# Altium schematic sheet BQ76940 20210906.SchDoc
size 419 x 297 mm
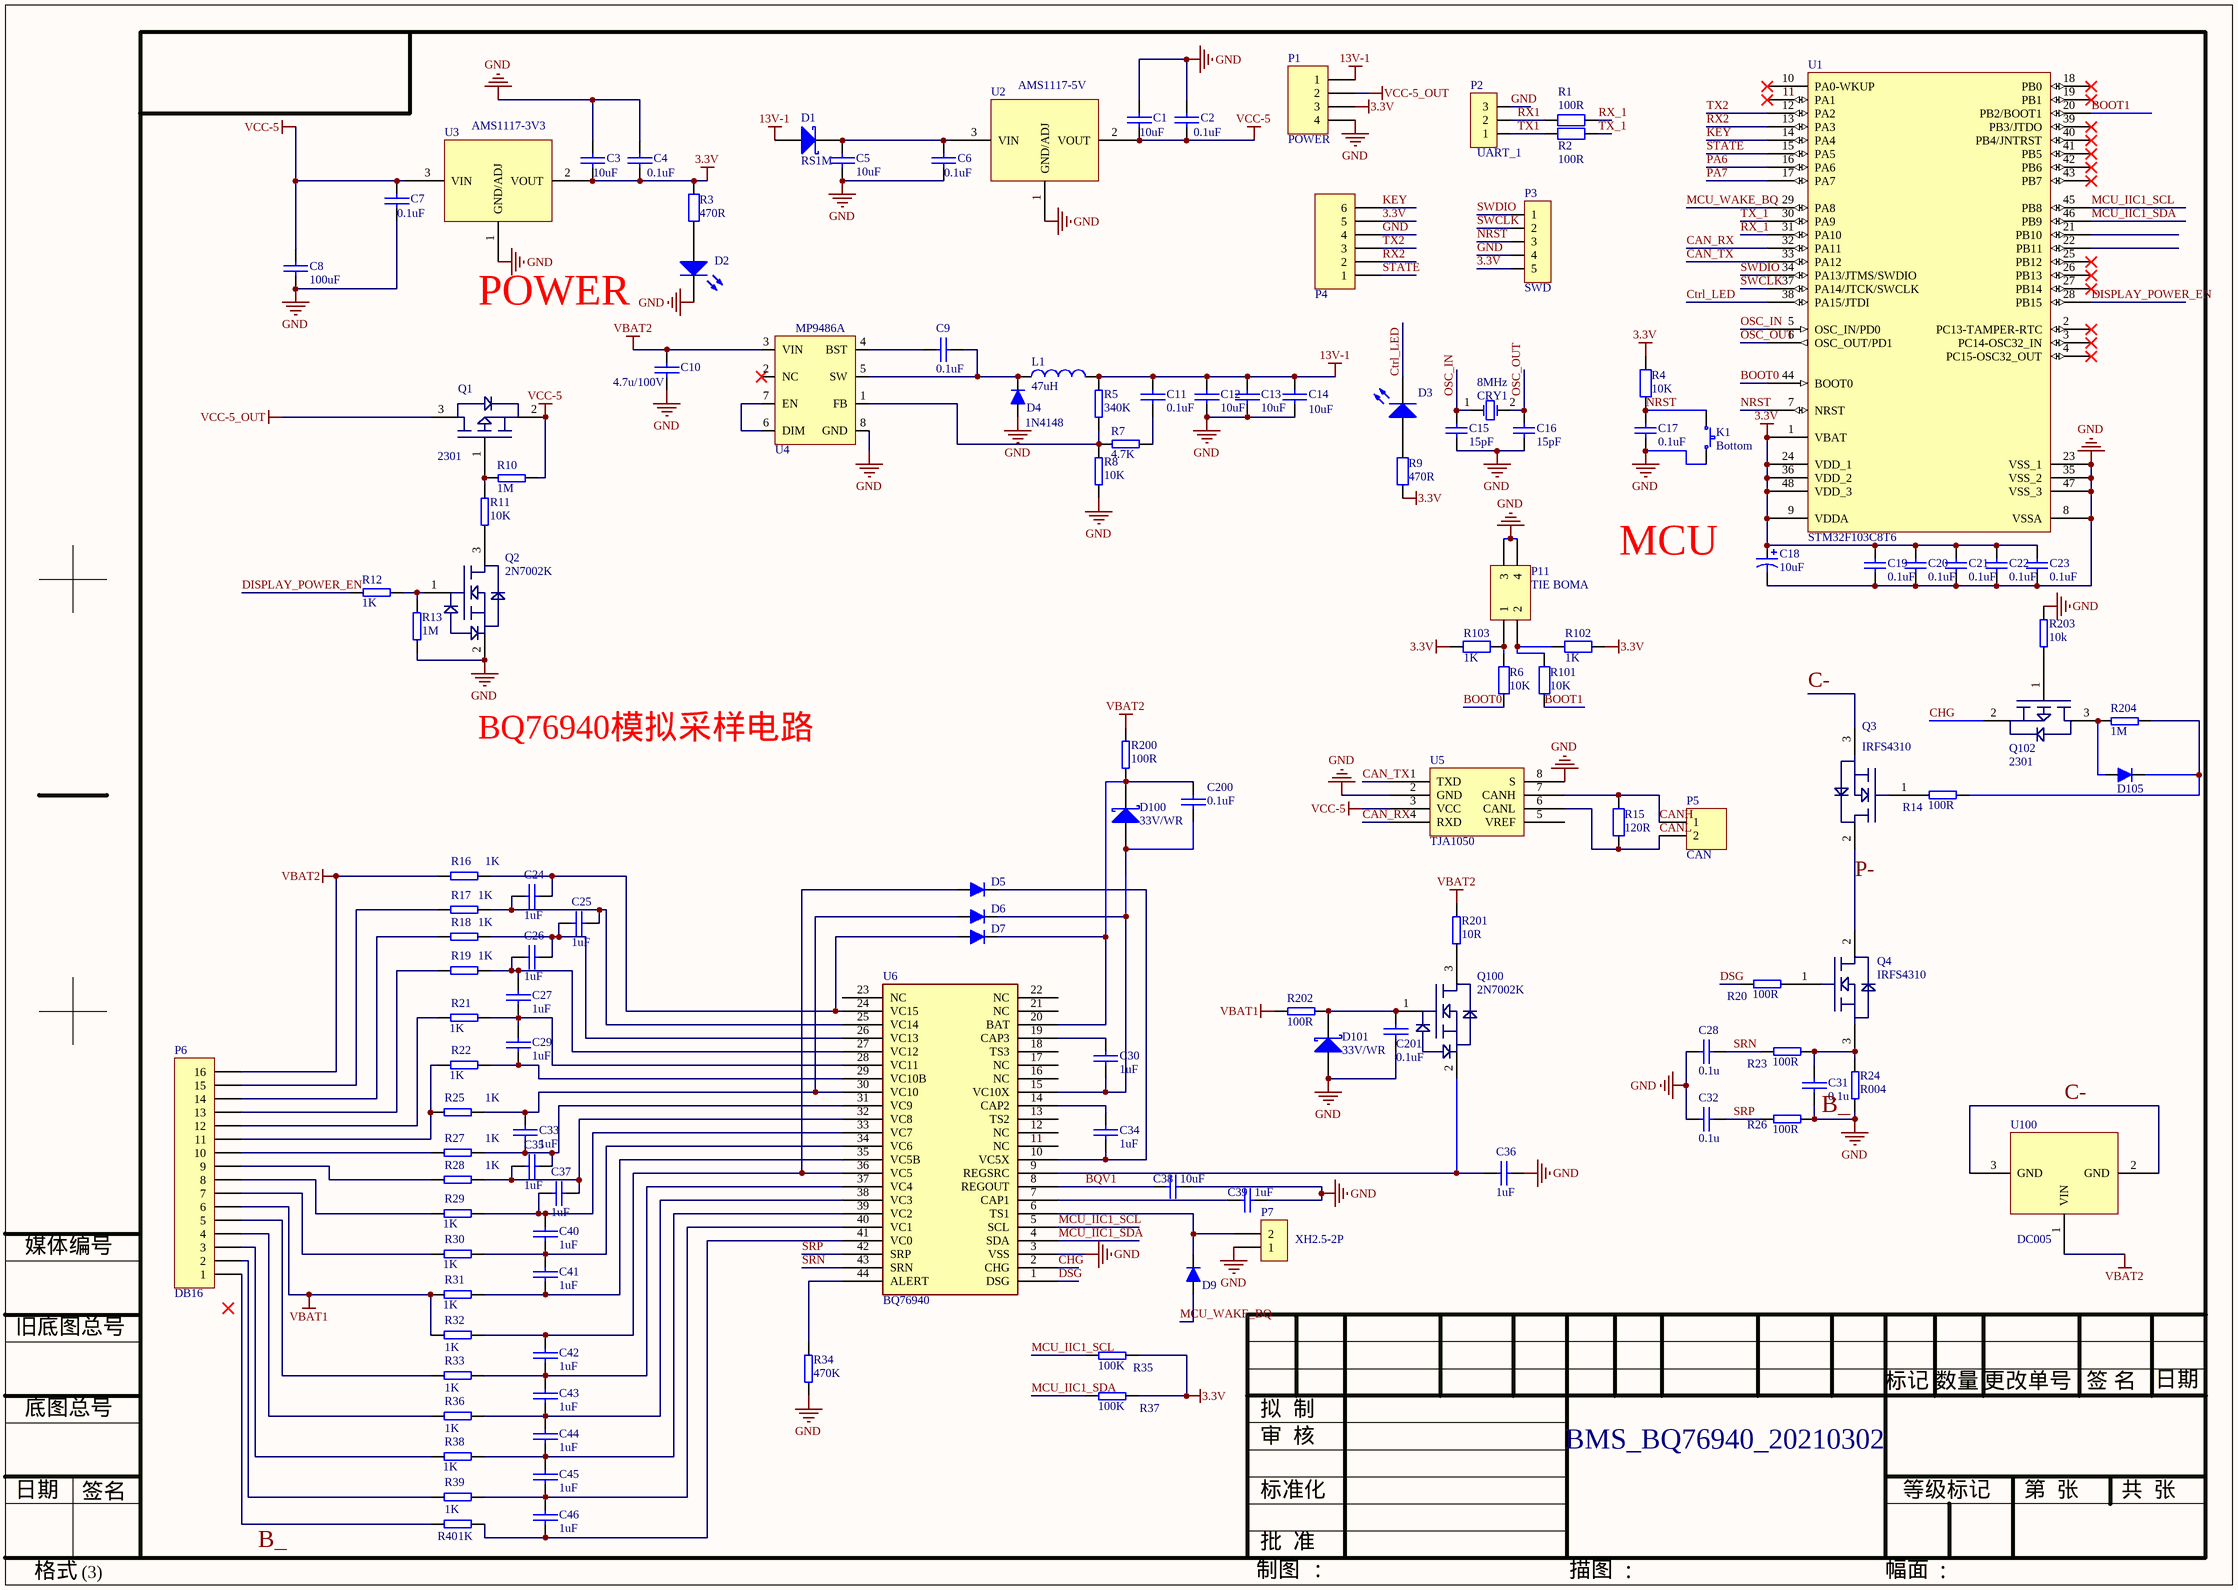
[diagram p0: BQ76940 20210906.SchDoc]

## Parts
C1  10uF  [C-0805]
C2  0.1uF  [C-0603]
C3  10uF  [C-0805]
C4  0.1uF  [C-0603]
C5  10uF  [C-0805]
C6  0.1uF  [C-0603]
C7  0.1uF  [C-0603]
C8  100uF  [C-0805]
C9  0.1uF  [C-0603]
C10  4.7u/100V  [4.7uF/100V]
C11  0.1uF  [C-0603]
C12  10uF  [C-0805]
C13  10uF  [C-0805]
C14  10uF  [C-0805]
C15  15pF  [C-0603]
C16  15pF  [C-0603]
C17  0.1uF  [C-0603]
C18  10uF  [C-3216/A]
C19  0.1uF  [C-0603]
C20  0.1uF  [C-0603]
C21  0.1uF  [C-0603]
C22  0.1uF  [C-0603]
C23  0.1uF  [C-0603]
C24  1uF  [C-0603]
C25  1uF  [C-0603]
C26  1uF  [C-0603]
C27  1uF  [C-0603]
C28  0.1u  [C-0603]
C29  1uF  [C-0603]
C30  1uF  [C-0603]
C31  0.1u  [C-0603]
C32  0.1u  [C-0603]
C33  1uF  [C-0603]
C34  1uF  [C-0603]
C35  1uF  [C-0603]
C36  1uF  [C-0603]
C37  1uF  [C-0603]
C38  10uF  [C-0603]
C39  1uF  [C-0603]
C40  1uF  [C-0603]
C41  1uF  [C-0603]
C42  1uF  [C-0603]
C43  1uF  [C-0603]
C44  1uF  [C-0603]
C45  1uF  [C-0603]
C46  1uF  [C-0603]
C200  0.1uF  [C-0603]
C201  0.1uF  [C-0603]
CRY1  8MHz  [CRY-HC-49US]
D1  RS1M  [SMA(DO-214AC)]
D2  SMT, LED  [LED-0603]  (value not drawn)
D3  SMT, LED  [LED-0603]  (value not drawn)
D4  1N4148  [LC-SOD-123]
D5  T3  [LC-SOD-123]  (value not drawn)
D6  T3  [LC-SOD-123]  (value not drawn)
D7  T3  [LC-SOD-123]  (value not drawn)
D9  T3  [LC-SOD-123]  (value not drawn)
D100  33V/WR  [LC-SOD-123]
D101  33V/WR  [LC-SOD-123]
D105  T3  [LC-SOD-123]  (value not drawn)
K1  *  [按键贴片]  (value not drawn)
L1  value 47uH  [47uH]  (hidden comment: L1)
P1  POWER  [XS4]
P2  UART_1  [XS3]
P3  SWD  [XS5]
P4  Bluetooth  [XS6]  (value not drawn)
P5  CAN  [XS2]
P6  DB16  [XS16]
P7  XH2.5-2P  [XS2]
P11  TIE BOMA  [LC-TIEBOMA]
Q1  2301  [LC-SOT-23(SOT-23-3)]
Q2  2N7002K  [LC-SOT-23(SOT-23-3)]
Q3  IRFS4310  [LC-TO-263-2]
Q4  IRFS4310  [LC-TO-263-2]
Q100  2N7002K  [LC-SOT-23(SOT-23-3)]
Q102  2301  [LC-SOT-23(SOT-23-3)]
R1  100R  [R-0603]
R2  100R  [R-0603]
R3  470R  [R-0603]
R4  10K  [R-0603]
R5  340K  [R-0603]
R6  10K  [R-0603]
R7  4.7K  [R-0603]
R8  10K  [R-0603]
R9  470R  [R-0603]
R10  1M  [R-0603]
R11  10K  [R-0603]
R12  1K  [R-0603]
R13  1M  [R-0603]
R14  100R  [R-0603]
R15  120R  [R-0603]
R16  1K  [R-0603]
R17  1K  [R-0603]
R18  1K  [R-0603]
R19  1K  [R-0603]
R20  100R  [R-0603]
R21  1K  [R-0603]
R22  1K  [R-0603]
R23  100R  [R-0603]
R24  R004  [LC-2512]
R25  1K  [R-0603]
R26  100R  [R-0603]
R27  1K  [R-0603]
R28  1K  [R-0603]
R29  1K  [R-0603]
R30  1K  [R-0603]
R31  1K  [R-0603]
R32  1K  [R-0603]
R33  1K  [R-0603]
R34  470K  [R-0603]
R35  100K  [R-0603]
R36  1K  [R-0603]
R37  100K  [R-0603]
R38  1K  [R-0603]
R39  1K  [R-0603]
R40  1K  [R-0603]
R101  10K  [R-0603]
R102  value 1K  [R-0603]  (hidden comment: 10K)
R103  value 1K  [R-0603]  (hidden comment: 10K)
R200  100R  [R-0603]
R201  10R  [R-0603]
R202  100R  [R-0603]
R203  10k  [R-0603]
R204  1M  [R-0603]
U1  STM32F103C8T6  [LQFP48_N]
U2  AMS1117-5V  [SOT-223]
U3  AMS1117-3V3  [SOT-223]
U4  MP9486A  [LC-SOIC-8_150mil]
U5  TJA1050  [LC-SOIC-8_150mil]
U6  BQ76940  [LC-TSSOP-44]
U100  DC005  [DC-005 5.5-2.0MM]

## Nets
3.3V: C3.2 C4.2 C18.1 C19.1 C20.1 C21.1 C22.1 C23.1 P1.3 P3.5 P4.5 R3.1 R4.1 R9.1 R35.1 R37.1 R102.1 R103.2 U1.1(VBAT) U1.9(VDDA) U1.24(VDD_1) U1.36(VDD_2) U1.48(VDD_3) U3.2(VOUT)
13V-1: C11.1 C12.1 C13.1 C14.1 D1.1(A) L1.2 P1.1 R5.2
B_: C1.1 C2.1 C3.1 C4.1 C5.2 C6.2 C7.2 C8.2 C10.1 C12.2 C13.2 C14.2 C15.1 C16.1 C17.2 C18.2 C19.2 C20.2 C21.2 C22.2 C23.2 C28.2 C31.2 C32.2 C36.2 C38.2 C39.2 C201.2 D2.2(K) D4.1(A) D101.1(A) K1.2 P1.4 P2.3 P3.4 P4.4 P6.1 P7.1 P11.3 P11.4 Q2.2 R8.1 R13.1 R24.2 R26.2 R34.1 R40.1 R203.2 U1.8(VSSA) U1.23(VSS_1) U1.35(VSS_2) U1.47(VSS_3) U2.1(GND/ADJ) U3.1(GND/ADJ) U4.8(GND) U5.2(GND) U5.8(S) U6.3(VSS)  [also labelled GND]
VBAT1: P6.6 R31.1 R32.1 R202.2
VBAT2: C10.2 P6.16 R16.1 R200.2 R201.2 U4.3(VIN) U100.1(VIN)
VCC-5: C1.2 C2.2 C7.1 C8.1 Q1.2 R10.1 U2.2(VOUT) U3.3(VIN) U5.3(VCC)
VCC-5_OUT: P1.2 Q1.3
BOOT0: R6.1 U1.44(BOOT0)
BOOT1: R101.1 U1.20(PB2/BOOT1)
BQV1: C38.1 U6.8(REGOUT)
C-: Q3.3 U100.2(GND) U100.3(GND)
CAN_RX: U1.32(PA11) U5.4(RXD)
CAN_TX: U1.33(PA12) U5.1(TXD)
CANH: P5.1 R15.2 U5.7(CANH)
CANL: P5.2 R15.1 U5.6(CANL)
CHG: Q102.2 U6.2(CHG)
Ctrl_LED: D3.2(K) U1.38(PA15/JTDI)
DISPLAY_POWER_EN: R12.1 U1.28(PB15)
DSG: R20.1 U6.1(DSG)
KEY: P4.6 U1.14(PA4)
MCU_IIC1_SCL: R35.2 U1.45(PB8) U6.5(SCL)
MCU_IIC1_SDA: R37.2 U1.46(PB9) U6.4(SDA)
MCU_WAKE_BQ: D9.1(A) U1.29(PA8)
NRST: C17.1 K1.1 P3.3 R4.2 U1.7(NRST)
OSC_IN: C15.2 CRY1.1(OSC1) U1.5(OSC_IN/PD0)
OSC_OUT: C16.2 CRY1.2(OSC2) U1.6(OSC_OUT/PD1)
P-: Q3.2 Q4.2
PA6: U1.16(PA6)
PA7: U1.17(PA7)
RX1: P2.2 R1.1
RX2: P4.2 U1.13(PA3)
RX_1: R1.2 U1.31(PA10)
SRN: C28.1 R23.1 U6.43(SRN)
SRP: C32.1 R26.1 U6.42(SRP)
STATE: P4.1 U1.15(PA5)
SWCLK: P3.2 U1.37(PA14/JTCK/SWCLK)
SWDIO: P3.1 U1.34(PA13/JTMS/SWDIO)
TX1: P2.1 R2.1
TX2: P4.3 U1.12(PA2)
TX_1: R2.2 U1.30(PA9)
NetC5_1: C5.1 C6.1 D1.2(K) U2.3(VIN)
NetC9_1: C9.1 U4.4(BST)
NetC9_2: C9.2 D4.2(K) L1.1 U4.5(SW)
NetC11_2: C11.2 R7.2
NetC24_1: C24.1 C25.2 R17.2 U6.25(VC14)
NetC24_2: C24.2 D7.1(A) R16.2 U6.24(VC15)
NetC25_1: C25.1 C26.2 R18.2 U6.26(VC13)
NetC26_1: C26.1 C27.1 R19.2 U6.27(VC12)
NetC27_2: C27.2 C29.1 R21.2 U6.28(VC11)
NetC29_2: C29.2 R22.2 U6.29(VC10B)
NetC30_1: C30.1 U6.19(CAP3)
NetC30_2: C30.2 C200.2 D6.2(K) D100.1(A) U6.15(VC10X)
NetC31_1: C31.1 Q4.3 R23.2 R24.1
NetC33_1: C33.1 D6.1(A) R25.2 U6.30(VC10)
NetC33_2: C33.2 C35.2 R27.2 U6.31(VC9)
NetC34_1: C34.1 U6.14(CAP2)
NetC34_2: C34.2 D5.2(K) U6.10(VC5X)
NetC35_1: C35.1 C37.2 R28.2 U6.32(VC8)
NetC36_1: C36.1 Q100.2 U6.9(REGSRC)
NetC37_1: C37.1 C40.1 R29.2 U6.33(VC7)
NetC39_1: C39.1 U6.7(CAP1)
NetC40_2: C40.2 C41.1 R30.2 U6.34(VC6)
NetC41_2: C41.2 R31.2 U6.35(VC5B)
NetC42_1: C42.1 D5.1(A) R32.2 U6.36(VC5)
NetC42_2: C42.2 C43.1 R33.2 U6.37(VC4)
NetC43_2: C43.2 C44.1 R36.2 U6.38(VC3)
NetC44_2: C44.2 C45.1 R38.2 U6.39(VC2)
NetC45_2: C45.2 C46.1 R39.2 U6.40(VC1)
NetC46_2: C46.2 R40.2 U6.41(VC0)
NetC200_1: C200.1 D7.2(K) D100.2(K) R200.1 U6.20(BAT)
NetC201_1: C201.1 D101.2(K) Q100.1 R202.1
NetD2_1: D2.1(A) R3.2
NetD3_1: D3.1(A) R9.2
NetD9_2: D9.2(K) P7.2 U6.6(TS1)
NetD105_1: D105.1(A) Q102.3 R204.2
NetD105_2: D105.2(K) R14.2 R204.1
NetP6_2: P6.2 R39.1
NetP6_3: P6.3 R38.1
NetP6_4: P6.4 R36.1
NetP6_5: P6.5 R33.1
NetP6_7: P6.7 R30.1
NetP6_8: P6.8 R29.1
NetP6_9: P6.9 R28.1
NetP6_10: P6.10 R27.1
NetP6_11: P6.11 R22.1 R25.1
NetP6_12: P6.12 R21.1
NetP6_13: P6.13 R19.1
NetP6_14: P6.14 R18.1
NetP6_15: P6.15 R17.1
NetP11_1: P11.1 R6.2 R103.1
NetP11_2: P11.2 R101.2 R102.2
NetQ1_1: Q1.1 R10.2 R11.1
NetQ2_1: Q2.1 R12.2 R13.2
NetQ2_3: Q2.3 R11.2
NetQ3_1: Q3.1 R14.1
NetQ4_1: Q4.1 R20.2
NetQ100_3: Q100.3 R201.1
NetQ102_1: Q102.1 R203.1
NetR5_1: R5.1 R7.1 R8.2 U4.1(FB)
NetR34_2: R34.2 U6.44(ALERT)
NetU4_6: U4.6(DIM) U4.7(EN)

Not connected (* = marked no-connect by the designer): U1 2(PC13-TAMPER-RTC)* 3(PC14-OSC32_IN)* 4(PC15-OSC32_OUT)* 10(PA0-WKUP)* 11(PA1)* 18(PB0)* 19(PB1)* 21(PB10) 22(PB11) 25(PB12)* 26(PB13)* 27(PB14)* 39(PB3/JTDO)* 40(PB4/JNTRST)* 41(PB5)* 42(PB6)* 43(PB7)*; U4 2(NC)*; U5 5(VREF); U6 11(NC) 12(NC) 13(TS2) 16(NC) 17(NC) 18(TS3) 21(NC) 22(NC) 23(NC)

## Notes on the sheet
- (near U3) POWER
- MCU
- BQ76940模拟采样电路
- BMS_BQ76940_20210302
- 媒体编号
- 旧底图总号
- 标记
- 数量
- 更改单号
- 签 名
- 日期
- 底图总号
- 拟  制
- 审  核
- 签名
- 标准化
- 等级标记
- 第  张
- 共  张
- 格式
- (3)
- 制图
- 批  准
- ：
- 描图
- 幅面
- (in symbol 按键) Bottom

## Library data of the parts
C1-C14 C24-C46 C200 C201 = CAP: Capacitor
C15-C17 C19-C23 = Cap: 0603; Published: 8-Jun-2000; LatestRevisionDate: 17-Jul-2002; LatestRevisionNote: Re-released for DXP Platform.; PackageReference: RAD-0.3; Publisher: Altium Limited
  C15 C16: Value: 15pF
  C17 C19-C23: Value: 0.1uF
C18 = Cap Pol1: 3216A; Published: 8-Jun-2000; LatestRevisionDate: 17-Jul-2002; LatestRevisionNote: Re-released for DXP Platform.; PackageReference: RB7.6-15; Publisher: Altium Limited; Value: 10uF
CRY1 = Crystal-2: Crystal, 2 pins
D1 D100 D101 = D Schottky: Schottky Diode, Footprint: SMA; Published: 8-Jun-2000; LatestRevisionDate: 17-Jul-2002; LatestRevisionNote: Re-released for DXP Platform.; PackageReference: SMB; Publisher: Altium Limited; Code_JEDEC: DO-214-AA
D2 D3 = LED0: LED, Footprint: 0603; Published: 8-Jun-2000; LatestRevisionDate: 08-Jul-2005; LatestRevisionNote: Mech Layer 1 removed.; PackageReference: LED-0; Publisher: Altium Limited
D4-D7 D9 D105 = DIODE
K1 = 按键
L1 = Inductor: Inductor, Footprint:; Code_IEC: 1005; Published: 8-Jun-2000; LatestRevisionDate: 17-Jul-2002; LatestRevisionNote: Re-released for DXP Platform.; PackageReference: 0402-A; Publisher: Altium Limited; Code_JEITA: 0402
P1 = Header 4: Header, 4-Pin; LatestRevisionDate: 17-Jul-2002; LatestRevisionNote: Re-released for DXP Platform.; Publisher: Altium Limited
P2 = CON3: Connector
P3 = CON5: Connector
P4 = Header 6: Header, 6-Pin; LatestRevisionDate: 17-Jul-2002; LatestRevisionNote: Re-released for DXP Platform.; Publisher: Altium Limited
P5 = Header 2: Header, 2-Pin; LatestRevisionDate: 17-Jul-2002; LatestRevisionNote: Re-released for DXP Platform.; Publisher: Altium Limited
P6 = Header 16_1: Header, 16-Pin; LatestRevisionDate: 17-Jul-2002; LatestRevisionNote: Re-released for DXP Platform.; Publisher: Altium Limited
P7 = CON2: Connector
P11 = TIE BOMA: Header, 2-Pin, Dual row; LatestRevisionDate: *; LatestRevisionNote: *; Publisher: *
Q1 Q102 = BSS84
R1-R3 R9 R15 = Res2: Resistor; Published: 8-Jun-2000; LatestRevisionDate: 17-Jul-2002; LatestRevisionNote: Re-released for DXP Platform.; PackageReference: AXIAL-0.4; Publisher: Altium Limited
  R1 R2: Value: 100R
  R3 R9: Value: 470R
  R15: Value: 120R
R4 R6 R101-R103 = Res2: 0603; Published: 8-Jun-2000; LatestRevisionDate: 17-Jul-2002; LatestRevisionNote: Re-released for DXP Platform.; PackageReference: AXIAL-0.4; Publisher: Altium Limited
  R4 R6 R101: Value: 10K
R5 R7 R8 R10-R14 R16-R40 R200-R204 = RES
U1 = STM32F103C8T6: STM32 ARM-based 32-bit MCU with 64 Kbytes Flash, 48-pin LQFP, Industrial Temperature; Published: 30-May-2008; DatasheetVersion: rev6, Mar-2008; PackageVersion: Mar-2008; PackageReference: LQFP48; Publisher: Altium Limited; PackageDescription: 48-Pin Low-Profile Quad Flat Pack, 7 x 7 mm Body, 0.5 mm Pitch (LQFP48); ComponentLink1Description: Manufacturer Link; ComponentLink1URL: www.st.com/stm32; ComponentLink2Description: Datasheet; ComponentLink2URL: http://www.st.com/stonline/products/literature/ds/13587.pdf
U2 U3 = AMS1117-3V3: SOT-223
U4 = MP2359
U5 = SN65VHD230
U100 = DC005: SOT-223